# EAGLE design HokuyoPoE (EAGLE 9.3.2)
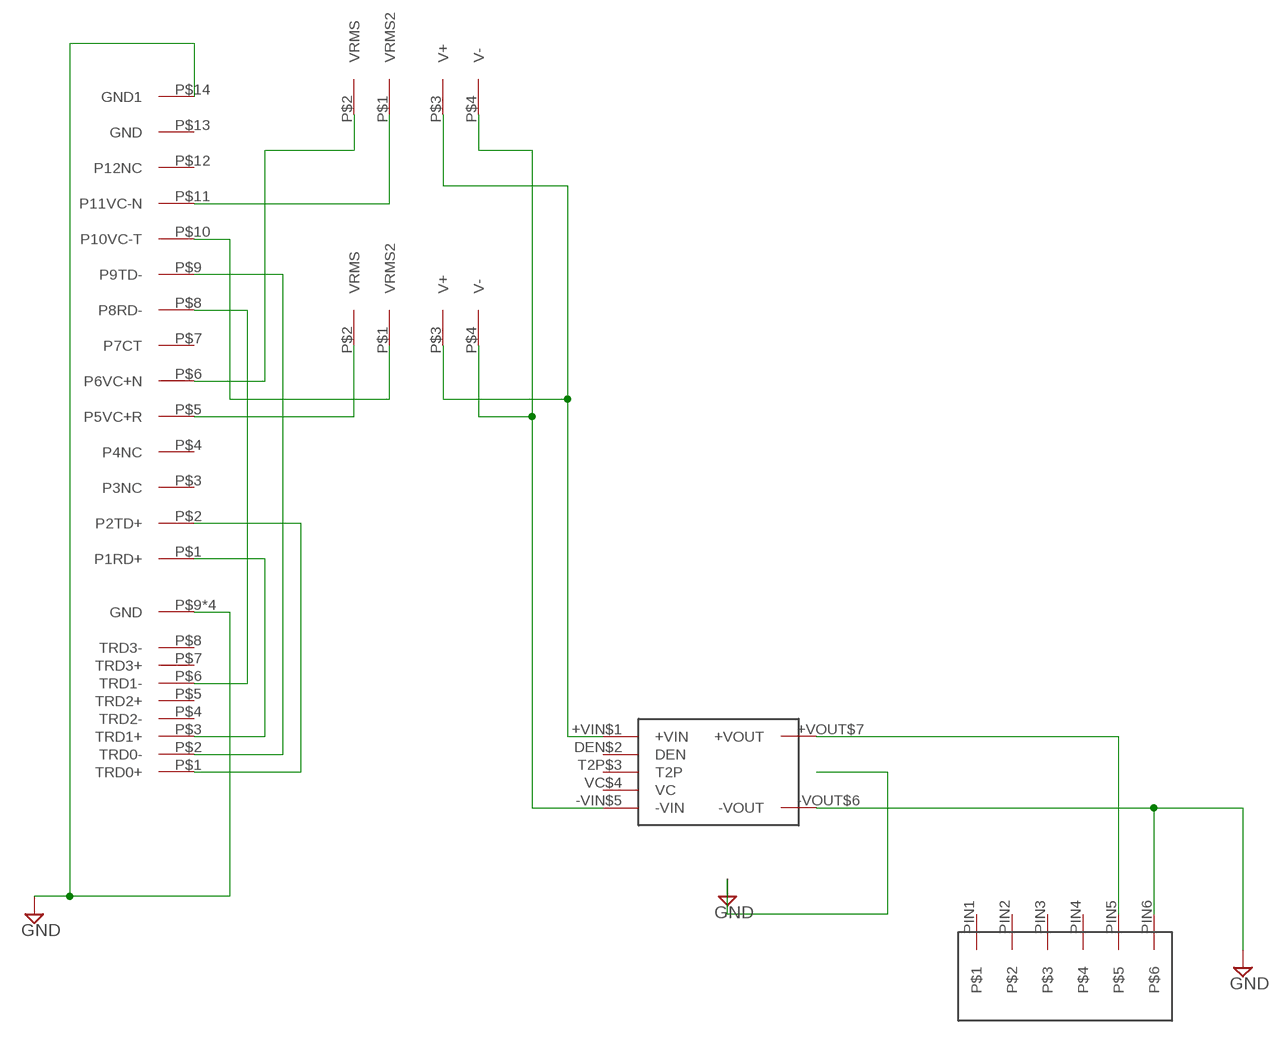
[diagram p0: schematic, sheet 1]

## Parts
U$1  MYBSP0122BABFT  [MYBSP0122BABFT]
U$2  7810-XPXC[RJ45]  [7810-XPXC[RJ45]]
U$3  B1010S  [B1010S]
U$4  SM08B-SRSS-TB  [SM08B-SRSS-TB]
U$5  0813-1X1T-57-F  [0813-1X1T-57-F]
U$6  B1010S  [B1010S]

## Nets
GND: U$1.-VOUT$6(-VOUT) U$2.P$9(GND) U$2.P$10(GND) U$2.P$11(GND) U$2.P$12(GND) U$4.PIN6 U$5.P$14(GND1)
N$1: U$2.P$3(TRD1+) U$5.P$1(P1RD+)
N$2: U$5.P$10(P10VC-T) U$6.P$1(VRMS2)
N$3: U$5.P$5(P5VC+R) U$6.P$2(VRMS)
N$4: U$3.P$1(VRMS2) U$5.P$11(P11VC-N)
N$5: U$3.P$2(VRMS) U$5.P$6(P6VC+N)
N$6: U$1.+VIN$1(+VIN) U$3.P$3(V+) U$6.P$3(V+)
N$7: U$2.P$6(TRD1-) U$5.P$8(P8RD-)
N$8: U$1.-VIN$5(-VIN) U$3.P$4(V-) U$6.P$4(V-)
N$9: U$2.P$1(TRD0+) U$5.P$2(P2TD+)
N$10: U$2.P$2(TRD0-) U$5.P$9(P9TD-)
N$11: U$5.P$13(GND)
N$22: U$1.+VOUT$7(+VOUT) U$4.PIN5
Unconnected: U$1.DEN$2(DEN) U$1.T2P$3(T2P) U$1.VC$4(VC) U$2.P$4(TRD2-) U$2.P$5(TRD2+) U$2.P$7(TRD3+) U$2.P$8(TRD3-) U$4.PIN1 U$4.PIN2 U$4.PIN3 U$4.PIN4 U$5.P$3(P3NC) U$5.P$4(P4NC) U$5.P$7(P7CT) U$5.P$12(P12NC)

## Library data of the parts
U$1 = HokyoParts:MYBSP0122BABFT
U$2 = HokyoParts:7810-XPXC[RJ45]
U$3 U$6 = HokyoParts:B1010S
U$4 = HokyoParts:SM08B-SRSS-TB
U$5 = HokyoParts:0813-1X1T-57-F

## Board
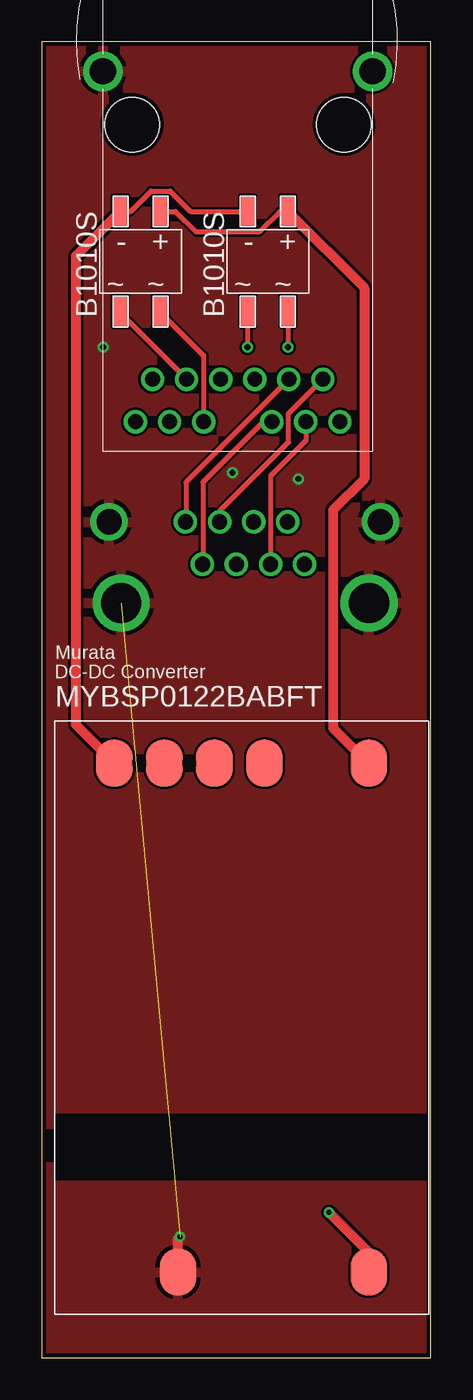
[diagram p1: board, top side]
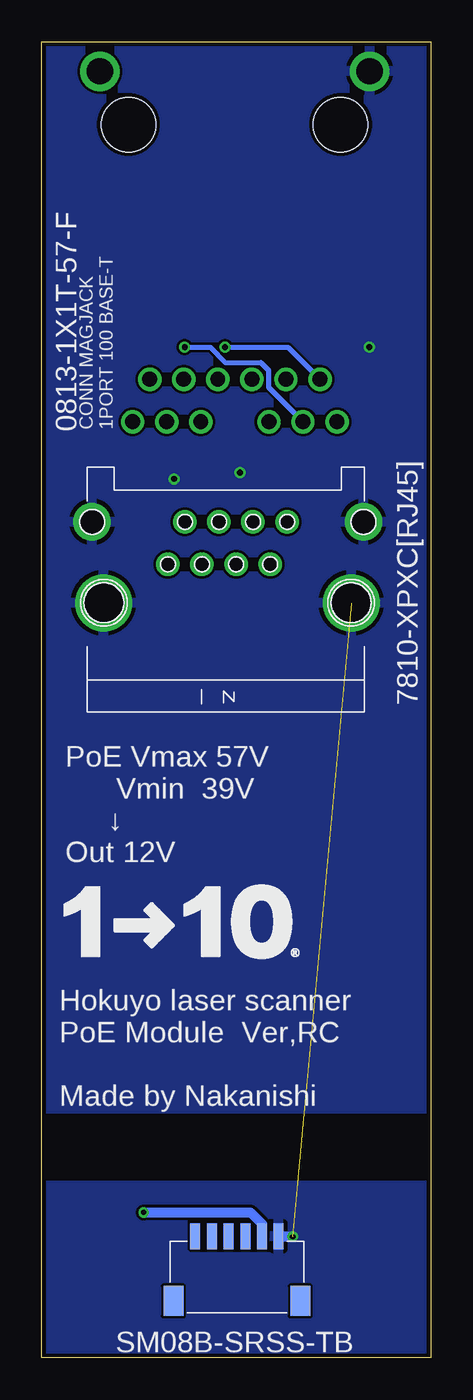
[diagram p2: board, bottom side, seen from below]

Size 23.29 x 78.73 mm. Coordinates in mm from the lower left corner, seen from the top.
Outline: 0,0 23.29,0 23.29,78.73 0,78.73 0,0
Copper layers (1*16): Top 0.035mm / dielectric 1.5mm / Bottom 0.035mm
Design rules "SeeedStudio_2layer_DRU_no_angle_20140221": minimum track width 6mil, minimum drill 12mil, track to track 6mil, track to pad 6mil, pad to pad 6mil, via to via 6mil, smd to smd 0mil, copper to edge 10mil, drill to drill 10mil, minimum pad ring 10mil, minimum via ring 6mil, stop-mask expansion 2mil, vias tented up to drill 100mil, thermal gap 10mil

### Footprints (pad centres in the part's own frame; a part is rotated, then mirrored left to right if it is on the bottom)
MYBSP0122BABFT = smd 2.8 x 2.2: +VIN$1 2.525,18.825; +VOUT$7 32.975,18.825; -VIN$5 2.525,3.575; -VOUT$6 32.975,7.4; DEN$2 2.525,12.575; T2P$3 2.525,9.575; VC$4 2.525,6.575
7810-XPXC[RJ45] = drill 0.9: P$1 -4.521,0.051; P$2 -5.537,-2.489; P$3 -6.579,0.051; P$4 -7.569,-2.489; P$5 -8.611,0.051; P$6 -9.627,-2.489; P$7 -10.643,0.051; P$8 -11.659,-2.489 | drill 1.5: P$9 -16.205,0.051; P$10 0.051,0.051 | drill 2.4: P$11 -15.519,-4.801; P$12 -0.686,-4.801
B1010S = smd 0.9 x 1.84: P$1 0,5.969; P$2 2.413,5.969; P$3 0,0; P$4 2.413,0
SM08B-SRSS-TB = smd 1.2 x 1.8: P$1 -7.01,-6.77; P$2 0.59,-6.77 | smd 0.6 x 1.55: PIN1 -5.71,-2.89; PIN2 -4.71,-2.89; PIN3 -3.71,-2.89; PIN4 -2.71,-2.89; PIN5 -1.71,-2.89; PIN6 -0.71,-2.89
0813-1X1T-57-F = drill 0.89: P$1 2.98,-18.42; P$2 5.02,-18.42; P$3 7.06,-18.42; P$4 9.1,-18.42; P$5 11.14,-18.42; P$6 13.18,-18.42; P$7 1.96,-20.96; P$8 4,-20.96; P$9 6.04,-20.96; P$10 10.12,-20.96; P$11 12.16,-20.96; P$12 14.2,-20.96 | drill 1.57: P$13 0,0; P$14 16.15,0 | hole 3.25: 1.71,-3.18; 14.41,-3.18

### Placement (x,y rotation side)
U$1  0.76,38.1 270 top
U$2  4.08,49.96 0 bottom
U$3  14.73,68.58 180 top
U$4  8.4,10.17 0 bottom
U$5  19.81,76.96 0 bottom
U$6  7.11,68.58 180 top

### Tracks (layer width: path | path; a pad name or v marks a point on that pad's centre or on a via)
GND  (via drill 0.3, 0.35)  (1 unrouted)
  Top 0.61: v8.27,7.24 8.16,7.14 U$1.-VOUT$6
  Bottom 0.61: U$4.PIN6 8.3,7.28 v8.27,7.24
  other vias: 3.68,60.45 11.43,52.96 15.37,52.58
  pour Bottom: -3.05,82.55 26.16,82.55 26.16,13.97 -4.32,13.97 -4.32,81.28
  pour Bottom: -4.32,11.43 26.16,11.43 26.16,-6.35 -4.32,-6.35
  pour Top: -3.05,82.55 26.16,82.55 26.16,13.97 -4.32,13.97 -4.32,81.28
  pour Top: -4.32,11.43 26.16,11.43 26.16,-6.35 -4.32,-6.35
N$1
  Top 0.305: U$5.P$1 14.78,56.49 14.78,54.77 10.66,50.64 U$2.P$3
N$2
  Top 0.305: U$6.P$1 7.11,62.54 9.69,59.96 U$5.P$10
N$3
  Top 0.305: U$6.P$2 4.7,62.51 U$5.P$5
N$4  (via drill 0.35)
  Top 0.305: U$3.P$1 v14.73,60.45
  Bottom 0.305: v14.73,60.45 13.21,60.45 12.31,59.55 10.17,59.55 9.71,59.08 9.71,58.06 U$5.P$11
N$5  (via drill 0.35)
  Top 0.305: U$3.P$2 v12.32,60.45
  Bottom 0.305: v12.32,60.45 8.54,60.45 U$5.P$6
N$6
  Top 0.305: U$6.P$3 8.01,68.58 9.24,67.36 13.02,67.36 14.25,68.58 U$3.P$3
  Top 0.61: U$3.P$3 19.3,64.01 19.3,52.58 17.43,50.7 17.43,37.69 19.26,35.86 19.3,35.86 U$1.+VIN$1
N$7
  Top 0.305: U$5.P$8 15.81,54.86 13.7,52.75 U$2.P$6
N$8
  Top 0.305: U$6.P$4 5.31,68.58 6.54,69.81 7.69,69.81 8.91,68.58 U$3.P$4
  Top 0.61: U$6.P$4 2.03,65.91 2.03,37.88 U$1.-VIN$5
N$9
  Top 0.305: U$5.P$2 8.64,52.39 8.64,50.05 U$2.P$1
N$10
  Top 0.305: U$2.P$2 9.65,47.5 9.65,52.38 13.26,56 U$5.P$9
N$22  (via drill 0.3)
  Top 0.61: U$1.+VOUT$7 19.59,6.29 v17.19,8.69
  Bottom 0.61: v17.19,8.69 10.8,8.69 10.11,8 U$4.PIN5

### Text on the board
tPlace: C:/Users/110Nakanishi/Documents/EAGLE/projects/HokuyoPoe/1-10holdings_logo-L.bmp | C:/Users/110Nakanishi/Documents/EAGLE/projects/HokuyoPoe/1-10holdings_logo-R.bmp
bPlace: CONN MAGJACK / 1PORT 100 BASE-T | PoE Vmax 57V / Vmin 39V / ↓ / Out 12V | Hokuyo laser scanner / PoE Module Ver,RC / / Made by Nakanishi | C:/Users/110Nakanishi/Documents/EAGLE/projects/HokuyoPoe/1-10holdings_logo-L.bmp
tNames: Murata | DC-DC Converter